# EAGLE design power_Section1.0 (EAGLE 8.3.2)
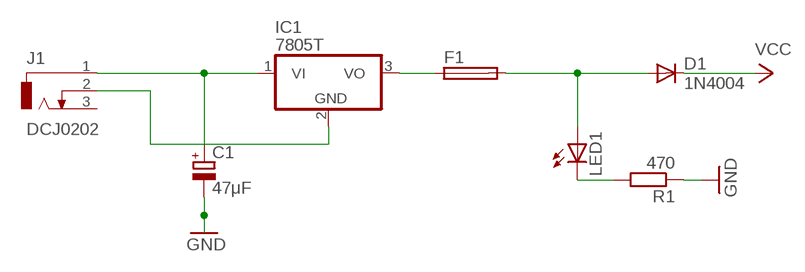
[diagram p0: schematic, sheet 1]

## Parts
C1  47μF  CPOL-EUE2.5-5  [E2,5-5]
D1  1N4004  [DO41-10]
F1  F457  [F457]
IC1  7805T  [TO220H]
J1  DCJ0202  [DCJ0202]
LED1  LED5MM  [LED5MM]
R1  470  R-EU_0207/10  [0207/10]

## Nets
GND: C1.- R1.1
N$1: C1.+ IC1.1(VI) J1.1
N$2: IC1.2(GND) J1.2
N$3: F1.1 IC1.3(VO)
N$4: D1.A F1.2 LED1.A
N$5: LED1.K(C) R1.2
VCC: D1.C
Unconnected: J1.3

## Library data of the parts
C1 = rcl:CPOL-EU: POLARIZED CAPACITOR, European symbol
D1 = adafruit:1N4004: DIODE General purpose 1N400x type rectifier (With bigger pads) http://www.ladyada.net/library/pcb/eaglelibrary.html
F1 = fuse:F457: FUSE HOLDER CS, Schukat; OC_FARNELL: unknown; OC_NEWARK: unknown
IC1 = adafruit:78*: Positive VOLTAGE REGULATOR Added bigger pads to the TO-92 package
J1 = con-jack:DCJ0202: DC POWER JACK Source: DCJ0202.pdf; OC_FARNELL: unknown; OC_NEWARK: unknown
LED1 = adafruit:LED: LED OSRAM: - CHIPLED LG R971, LG N971, LY N971, LG Q971, LY Q971, LO R971, LY R971 LH N974, LH R974 LS Q976, LO Q976, LY Q976 LO Q996 - Hyper CHIPLED LW Q18S LB Q993, LB Q99A, LB R99A - SideLED LS A670, LO A670, LY A670, LG A670, LP A670 LB A673, LV A673, LT A673, LW A673 LH A674 LY A675 LS A676, LA A676, LO A676, LY A676, LW A676 LS A679, LY A679, LG A679 - Hyper Micro SIDELED® LS Y876, LA Y876, LO Y876, LY Y876 LT Y87S - SmartLED LW L88C, LW L88S LB L89C, LB L89S, LG L890 LS L89K, LO L89K, LY L89K LS L896, LA L896, LO L896, LY L896 - TOPLED LS T670, LO T670, LY T670, LG T670, LP T670 LSG T670, LSP T670, LSY T670, LOP T670, LYG T670 LG T671, LOG T671, LSG T671 LB T673, LV T673, LT T673, LW T673 LH T674 LS T676, LA T676, LO T676, LY T676, LB T676, LH T676, LSB T676, LW T676 LB T67C, LV T67C, LT T67C, LS T67K, LO T67K, LY T67K, LW E67C LS E67B, LA E67B, LO E67B, LY E67B, LB E67C, LV E67C, LT E67C LW T67C LS T679, LY T679, LG T679 LS T770, LO T770, LY T770, LG T770, LP T770 LB T773, LV T773, LT T773, LW T773 LH T774 LS E675, LA E675, LY E675, LS T675 LS T776, LA T776, LO T776, LY T776, LB T776 LHGB T686 LT T68C, LB T68C - Hyper Mini TOPLED® LB M676 - Mini TOPLED Santana® LG M470 LS M47K, LO M47K, LY M47K Source: http://www.osram.convergy.de/
R1 = rcl:R-EU_: RESISTOR, European symbol

## Board
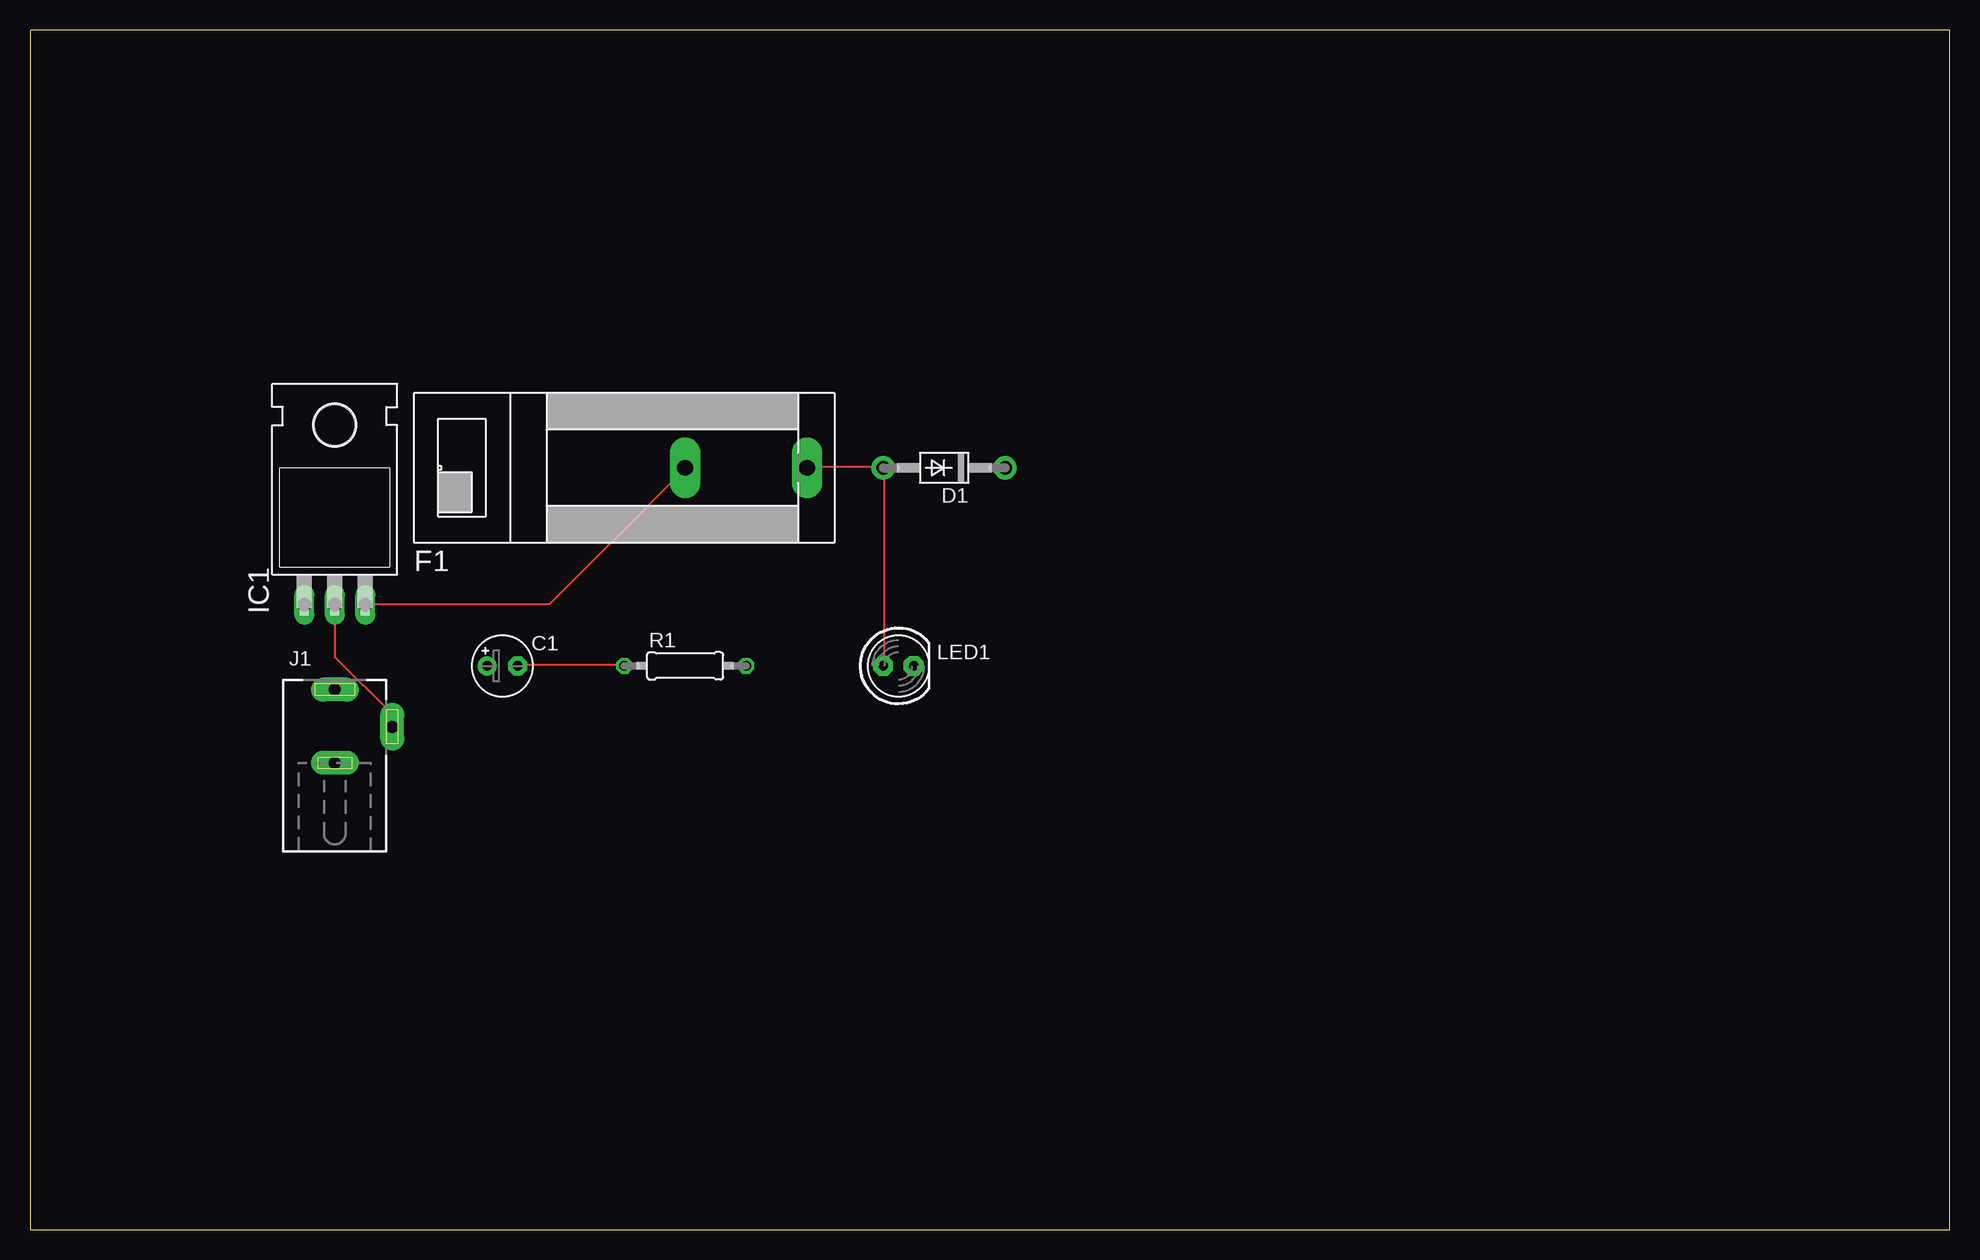
[diagram p1: board, top side]
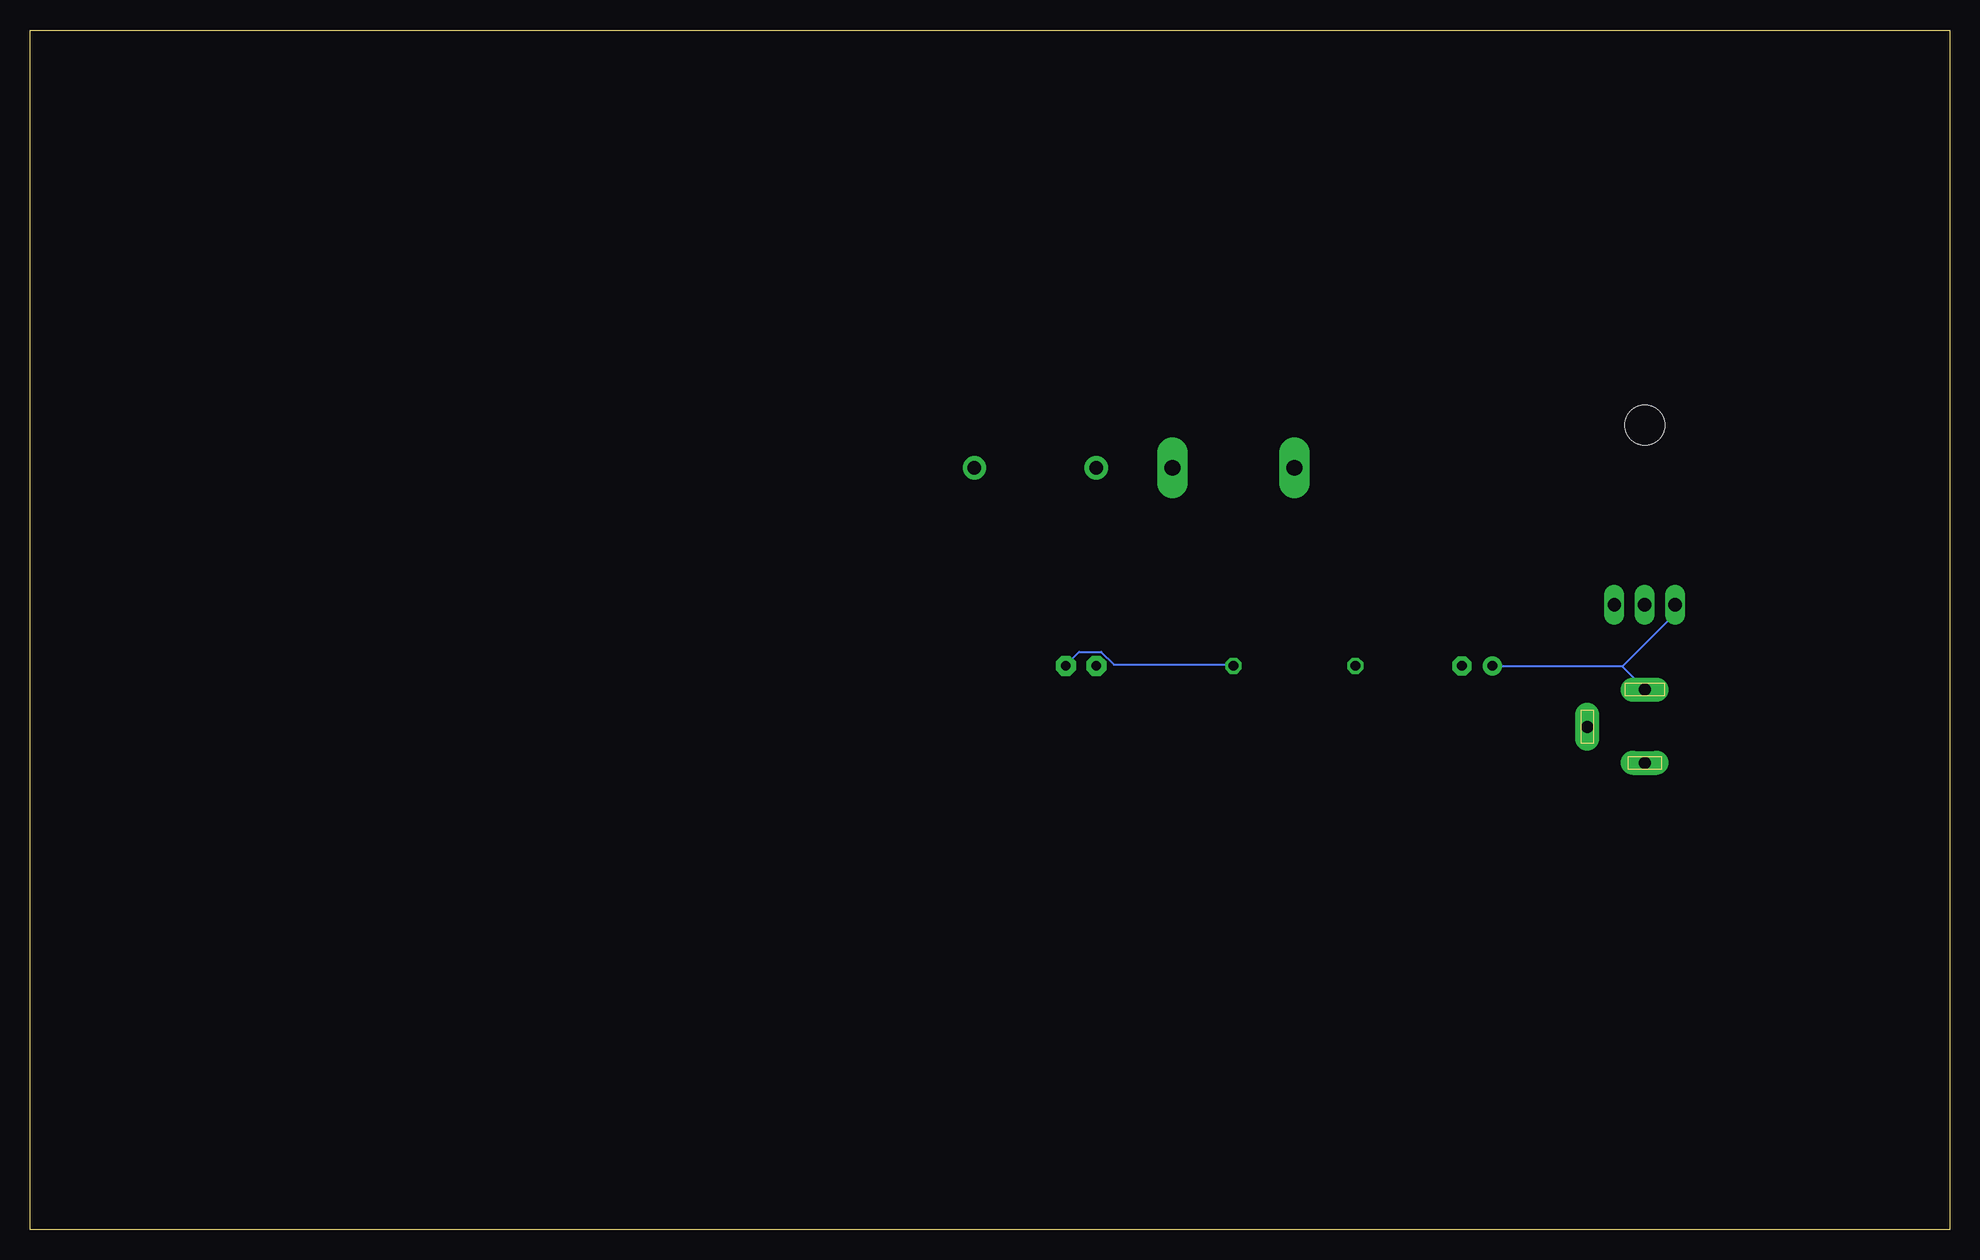
[diagram p2: board, bottom side, seen from below]

Size 160 x 100 mm. Coordinates in mm from the lower left corner, seen from the top.
Outline: 0,0 160,0 160,100 0,100 0,0
Copper layers (1*16): Top 0.035mm / dielectric 1.5mm / Bottom 0.035mm
Design rules "default": minimum track width 6mil, minimum drill 0.35mm, track to track 6mil, track to pad 6mil, pad to pad 6mil, via to via 6mil, smd to smd 6mil, copper to edge 40mil, drill to drill 6mil, minimum pad ring 10mil, minimum via ring 8mil, stop-mask expansion 4mil, vias tented up to drill 0mil, thermal gap 10mil

### Footprints (pad centres in the part's own frame; a part is rotated, then mirrored left to right if it is on the bottom)
E2,5-5 = drill 0.813 pad 1.6: + -1.27,0 | drill 0.813 pad 1.6 octagon: - 1.27,0
DO41-10 = drill 1.118 pad 1.93: A 5.08,0; C -5.08,0
F457 = drill 1.321 pad 2.54 long: 1 -5.08,0; 2 5.08,0
TO220H = drill 1.118 long: 1 -2.54,-10.16; 2 0,-10.16; 3 2.54,-10.16 | hole 3.302: 0,4.826
DCJ0202 = drill 1 pad 2 long: 1 0,3.1; 2 4.8,0; 3 0,-3
LED5MM = drill 0.813 pad 1.676 octagon: A -1.27,0; K 1.27,0
0207/10 = drill 0.813 octagon: 1 -5.08,0; 2 5.08,0

### Placement (x,y rotation side)
C1  39.37,46.99 0 top
D1  76.2,63.5 180 top
F1  59.69,63.5 0 top
IC1  25.4,62.23 0 top
J1  25.4,41.91 0 top
LED1  72.39,46.99 0 top
R1  54.61,46.99 0 top

### Tracks (layer width: path | path; a pad name or v marks a point on that pad's centre or on a via)
GND
  Top 0.152: R1.1 49.53,47.09 40.69,47.09 C1.-
N$1
  Bottom 0.152: 27.28,46.94 38.1,46.94 C1.+ | 27.28,46.94 25.45,45.11 J1.1 | IC1.1 22.86,51.36 27.28,46.94
N$2
  Top 0.152: IC1.2 25.45,51.97 25.45,47.7 30.18,42.98 30.18,41.91 J1.2
N$3
  Top 0.152: IC1.3 28.04,52.12 43.28,52.12 54.56,63.4 F1.1
N$4
  Top 0.152: LED1.A 71.17,47.09 71.17,63.4 D1.A 71.02,63.55 64.77,63.55 F1.2
N$5
  Bottom 0.152: R1.2 59.74,47.09 69.65,47.09 70.71,48.16 72.54,48.16 73.61,47.09 LED1.K